# Altium schematic sheet TGCC-HC-1 RF Module.SchDoc
size A4
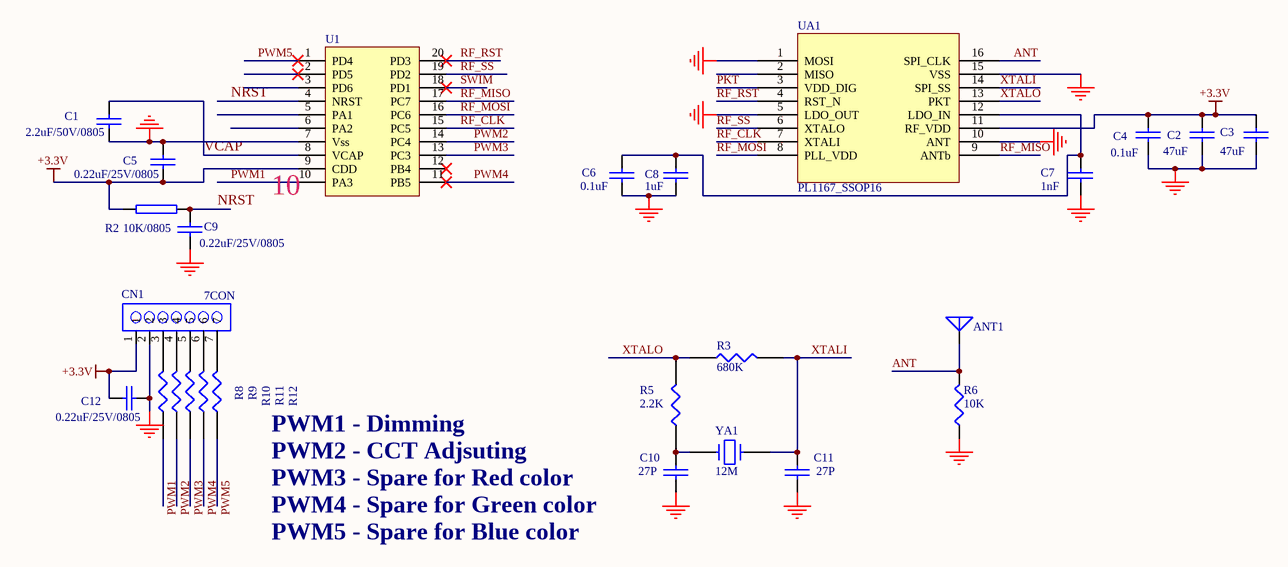
[diagram p0: TGCC-HC-1 RF Module.SchDoc]

## Parts
ANT1  (no value)
C1  2.2uF/50V/0805  [0402]
C2  47uF  [0402]
C3  47uF  [0402]
C4  0.1uF  [0402]
C5  0.22uF/25V/0805  [0402]
C6  0.1uF  [0402]
C7  1nF  [0402]
C8  1uF  [0402]
C9  0.22uF/25V/0805  [0402]
C10  27P  [0402]
C11  27P  [0402]
C12  0.22uF/25V/0805  [0402]
CN1  7CON  [HDR1X7]
R2  10K/0805  [0402]
R3  680K  [0402]
R5  2.2K  [0402]
R6  10K  [0402]
R8  (no value)  [0402]
R9  (no value)  [0402]
R10  (no value)  [0402]
R11  (no value)  [0402]
R12  (no value)  [0402]
U1  (no value)  [MCU]
UA1  PL1167_SSOP16  [SSOP-16]
YA1  12M  [XTAL-SMD]

## Nets
+3.3V: C2.1 C3.1 C4.1 C5.2 C12.1 CN1.1 R2.2 U1.9(CDD) UA1.11(RF_VDD)
GND: C1.2 C2.2 C3.2 C4.2 C5.1 C6.2 C7.2 C8.2 C9.2 C10.2 C11.2 C12.2 CN1.2 R6.1 U1.7(Vss) UA1.1(MOSI) UA1.5(LDO_OUT) UA1.10(ANT) UA1.15(VSS)
ANT: ANT1.1(A) R6.2 UA1.16(SPI_CLK)
NRST: C9.1 R2.1 U1.4(NRST)
PKT: UA1.3(VDD_DIG)
PWM1: R8.1 U1.10(PA3)
PWM2: R9.1 U1.14(PC4)
PWM3: R10.1 U1.13(PC3)
PWM4: R11.1 U1.11(PB5)
PWM5: R12.1 U1.1(PD4)
RF_CLK: U1.15(PC5) UA1.7(XTALI)
RF_MISO: U1.17(PC7) UA1.9(ANTb)
RF_MOSI: U1.16(PC6) UA1.8(PLL_VDD)
RF_RST: U1.20(PD3) UA1.4(RST_N)
RF_SS: U1.19(PD2) UA1.6(XTALO)
SWIM: U1.18(PD1)
VCAP: C1.1 U1.8(VCAP)
XTALI: C11.1 R3.2 UA1.14(SPI_SS) YA1.2
XTALO: R3.1 R5.2 UA1.13(PKT)
NetC6_1: C6.1 C7.1 C8.1 UA1.12(LDO_IN)
NetC10_1: C10.1 R5.1 YA1.1
NetCN1_3: CN1.3 R8.2
NetCN1_4: CN1.4 R9.2
NetCN1_5: CN1.5 R10.2
NetCN1_6: CN1.6 R11.2
NetCN1_7: CN1.7 R12.2

Not connected (* = marked no-connect by the designer): U1 2(PD5)* 3(PD6) 5(PA1) 6(PA2) 12(PB4)*; UA1 2(MISO)

## Notes on the sheet
- (near U1) 10
- PWM1 - Dimming
- PWM2 - CCT Adjsuting
- PWM3 - Spare for Red color
- PWM4 - Spare for Green color
- PWM5 - Spare for Blue color

## Library data of the parts
ANT1 = ANTENNA: Generic Antenna
C1 C5 C9 C12 = CAP
C2-C4 C6-C8 C10 C11 = CAP: Capacitor
R2 = RES2: Part Field 1: *; Part Field 2: *; Part Field 3: *; Part Field 4: *; Part Field 5: *; Part Field 6: *; Part Field 7: *; Part Field 8: *; Part Field 9: *; Part Field 10: *; Part Field 11: *; Part Field 12: *; Part Field 13: *; Part Field 14: *; Part Field 15: *; Part Field 16: *
R3 R5 R6 R8-R12 = RES1
U1 = STM8S103
UA1 = CW1803
YA1 = CRYSTAL